# EAGLE design PGA-103+ LNA Mod2 (EAGLE 7.7.0)
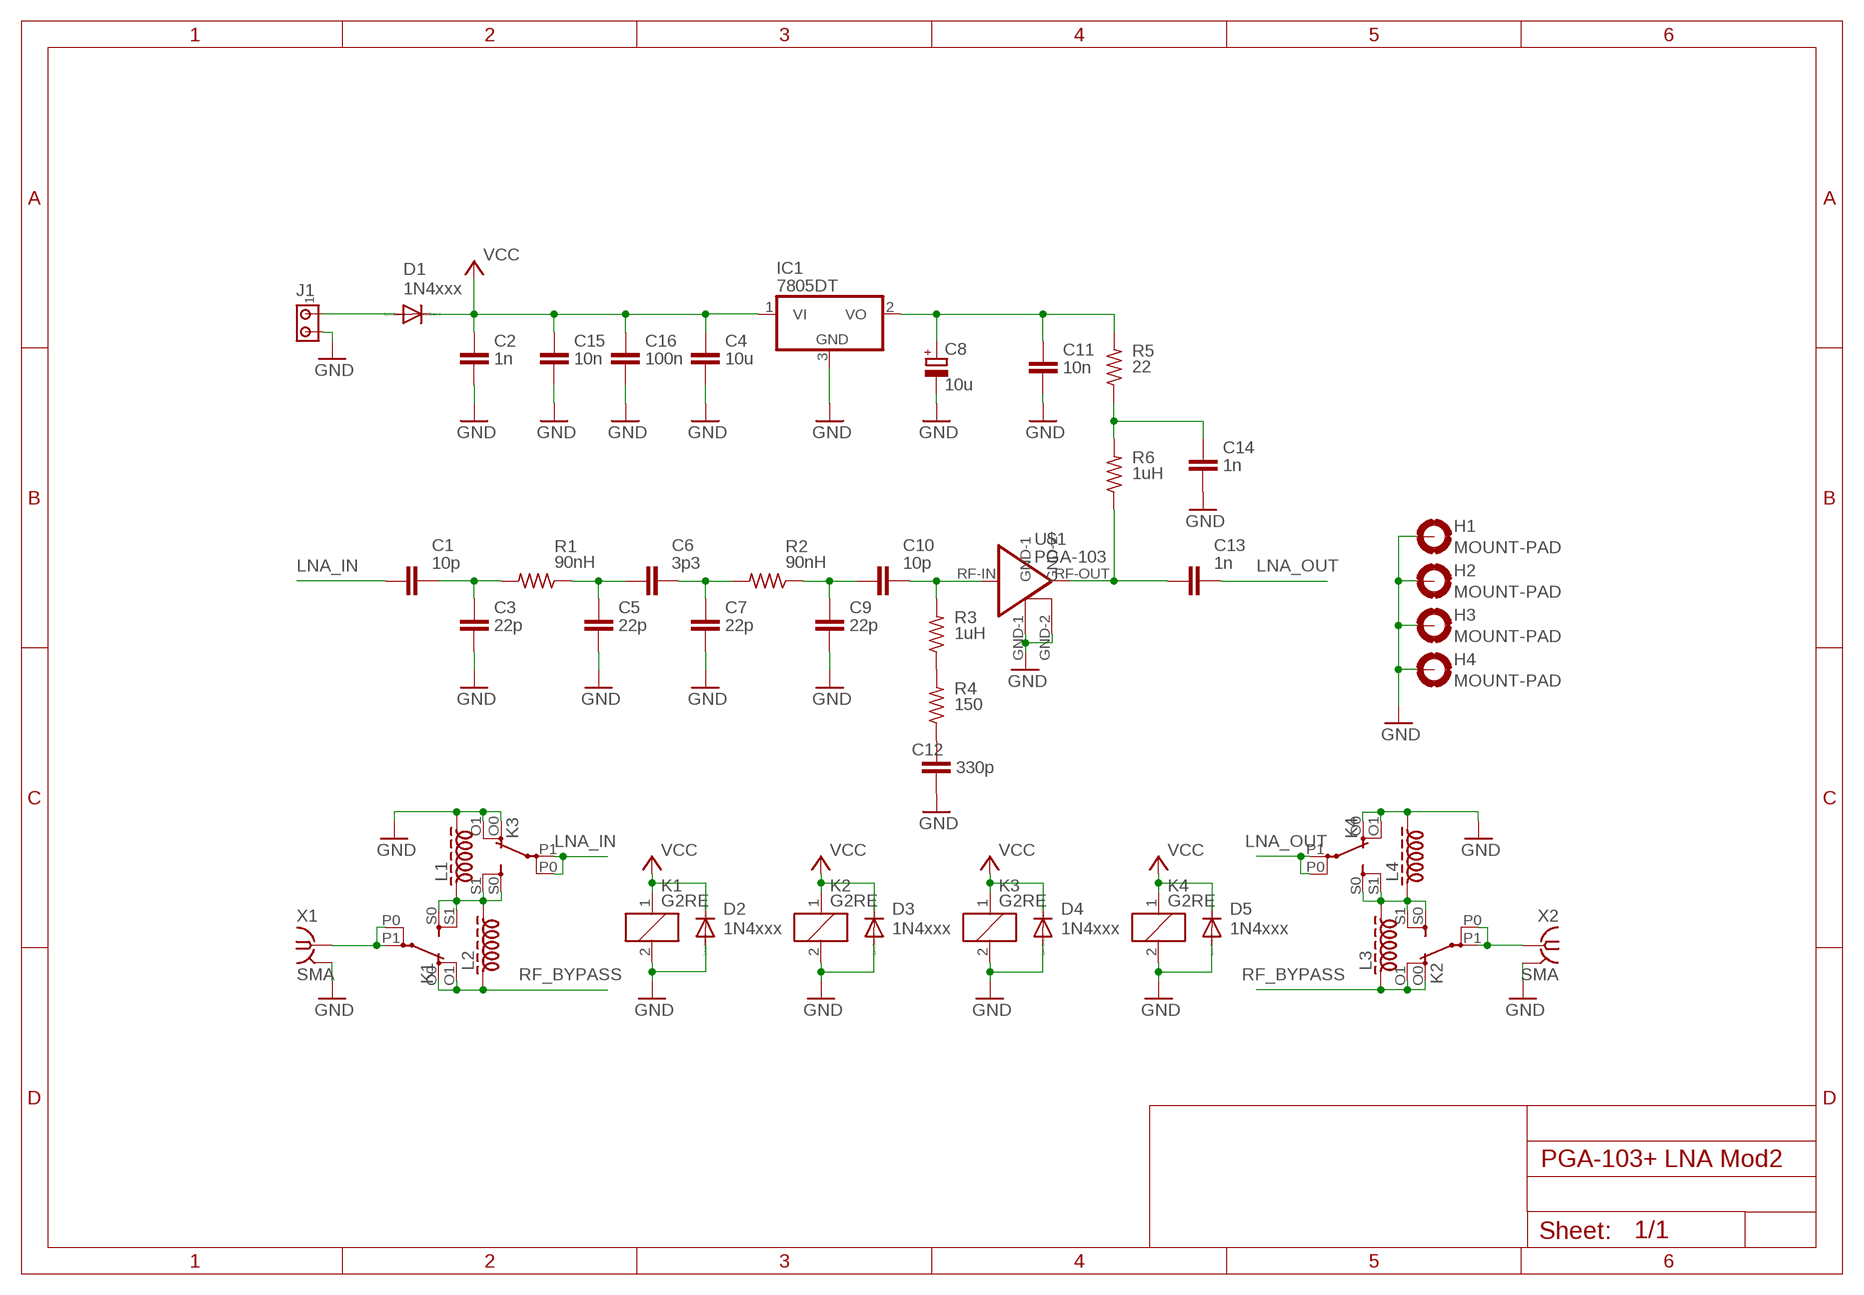
[diagram p0: schematic, sheet 1]

## Parts
C1  10p  C-EUC1206  [C1206]
C2  1n  C-EUC1206  [C1206]
C3  22p  C-EUC1206  [C1206]
C4  10u  C-EUC1206  [C1206]
C5  22p  C-EUC1206  [C1206]
C6  3p3  C-EUC1206  [C1206]
C7  22p  C-EUC1206  [C1206]
C8  10u  CPOL-EUB/3528-21R  [B/3528-21R]
C9  22p  C-EUC1206  [C1206]
C10  10p  C-EUC1206  [C1206]
C11  10n  C-EUC1206  [C1206]
C12  330p  C-EUC1206  [C1206]
C13  1n  C-EUC1206  [C1206]
C14  1n  C-EUC1206  [C1206]
C15  10n  C-EUC1206  [C1206]
C16  100n  C-EUC1206  [C1206]
D1  1N4xxx  1N4148DO35-7  [DO35-7]
D2  1N4xxx  1N4148DO35-7  [DO35-7]
D3  1N4xxx  1N4148DO35-7  [DO35-7]
D4  1N4xxx  1N4148DO35-7  [DO35-7]
D5  1N4xxx  1N4148DO35-7  [DO35-7]
H1  MOUNT-PAD  MOUNT-PAD-ROUND2.8  [2,8-PAD]
H2  MOUNT-PAD  MOUNT-PAD-ROUND2.8  [2,8-PAD]
H3  MOUNT-PAD  MOUNT-PAD-ROUND2.8  [2,8-PAD]
H4  MOUNT-PAD  MOUNT-PAD-ROUND2.8  [2,8-PAD]
IC1  7805DT  [TO252]
J1  MTA02-156  [1X2MTA]
K1  G2RE  [G2RE]
K2  G2RE  [G2RE]
K3  G2RE  [G2RE]
K4  G2RE  [G2RE]
L1  Z28/70CW  [Z28/7]
L2  Z28/70CW  [Z28/7]
L3  Z28/70CW  [Z28/7]
L4  Z28/70CW  [Z28/7]
R1  90nH  R-US_M1206  [M1206]
R2  90nH  R-US_M1206  [M1206]
R3  1uH  R-US_M1206  [M1206]
R4  150  R-US_M1206  [M1206]
R5  22  R-US_M1206  [M1206]
R6  1uH  R-US_M1206  [M1206]
U$1  PGA-103  [DF782]
X1  SMA  SMA-142-0701-851/861  [J502-ND-142-0701-851/861]
X2  SMA  SMA-142-0701-851/861  [J502-ND-142-0701-851/861]

## Nets
ANT: K1.P0(2:P) K1.P1(2:P) X1.1
GND: C2.2 C3.1 C4.2 C5.1 C7.1 C8.- C9.1 C11.2 C12.1 C14.1 C15.2 C16.2 D2.A D3.A D4.A D5.A H1.B2,8(MOUNT) H2.B2,8(MOUNT) H3.B2,8(MOUNT) H4.B2,8(MOUNT) IC1.3(GND) J1.2 K1.2 K2.2 K3.2 K3.O0(2:O) K3.O1(2:O) K4.2 K4.O0(2:O) K4.O1(2:O) L1.2 L4.2 U$1.GND-1 U$1.GND-2 X1.G@1 X1.G@2 X1.G@3 X1.G@4 X2.G@1 X2.G@2 X2.G@3 X2.G@4
LNA_IN: C1.1 K3.P0(2:P) K3.P1(2:P)
LNA_OUT: C13.2 K4.P0(2:P) K4.P1(2:P)
N$1: C10.2 R3.2 U$1.RF-IN
N$3: C13.1 R6.1 U$1.RF-OUT
N$5: C8.+ C11.1 IC1.2(VO) R5.2
N$7: D1.A J1.1
N$8: C9.2 C10.1 R2.1
N$9: C14.2 R5.1 R6.2
N$10: R3.1 R4.2
N$11: C12.2 R4.1
N$12: C6.2 C7.2 R2.2
N$13: C5.2 C6.1 R1.1
N$14: C1.2 C3.2 R1.2
N$16: K1.S0(2:S) K1.S1(2:S) K3.S0(2:S) K3.S1(2:S) L1.1 L2.2
N$17: K2.S0(2:S) K2.S1(2:S) K4.S0(2:S) K4.S1(2:S) L3.2 L4.1
RF_BYPASS: K1.O0(2:O) K1.O1(2:O) K2.O0(2:O) K2.O1(2:O) L2.1 L3.1
TRX: K2.P0(2:P) K2.P1(2:P) X2.1
VCC: C2.1 C4.1 C15.1 C16.1 D1.C D2.C D3.C D4.C D5.C IC1.1(VI) K1.1 K2.1 K3.1 K4.1

## Library data of the parts
C1-C7 C9-C16 = rcl:C-EU: CAPACITOR, European symbol
C8 = rcl:CPOL-EU: POLARIZED CAPACITOR, European symbol
D1-D5 = diode:1N4148: DIODE high speed (Philips)
H1-H4 = holes:MOUNT-PAD-ROUND: MOUNTING PAD, round
IC1 = linear:78*: Positive VOLTAGE REGULATOR Source: http://cache.national.com/ds/LM/LM78L05.pdf http://www.fairchildsemi.com/ds/LM/LM7805.pdf
J1 = con-amp:MTA02-156: AMP connector
K1-K4 = relay:G2RE: RELAY 1 x switch, high current, Omron; OC_FARNELL: unknown; OC_NEWARK: unknown
L1-L4 = inductor-neosid:Z?CW: CHOKE free-suspension choke/nominal inductance winding clockwise; OC_FARNELL: unknown; OC_NEWARK: unknown
R1-R6 = rcl:R-US_: RESISTOR, American symbol
U$1 = minicircuits:PGA-103
X1 X2 = con-coax:SMA-: SMA 50 Ohm End Launch Jack Receptacle - Round Contact Johnson Components Source: www.johnsoncomponents.com .. J502-ND.pdf; MF: JOHNSON COMPONENTS; MPN: 142-0701-851; OC_FARNELL: 1019325; OC_NEWARK: 99F6798

## Board
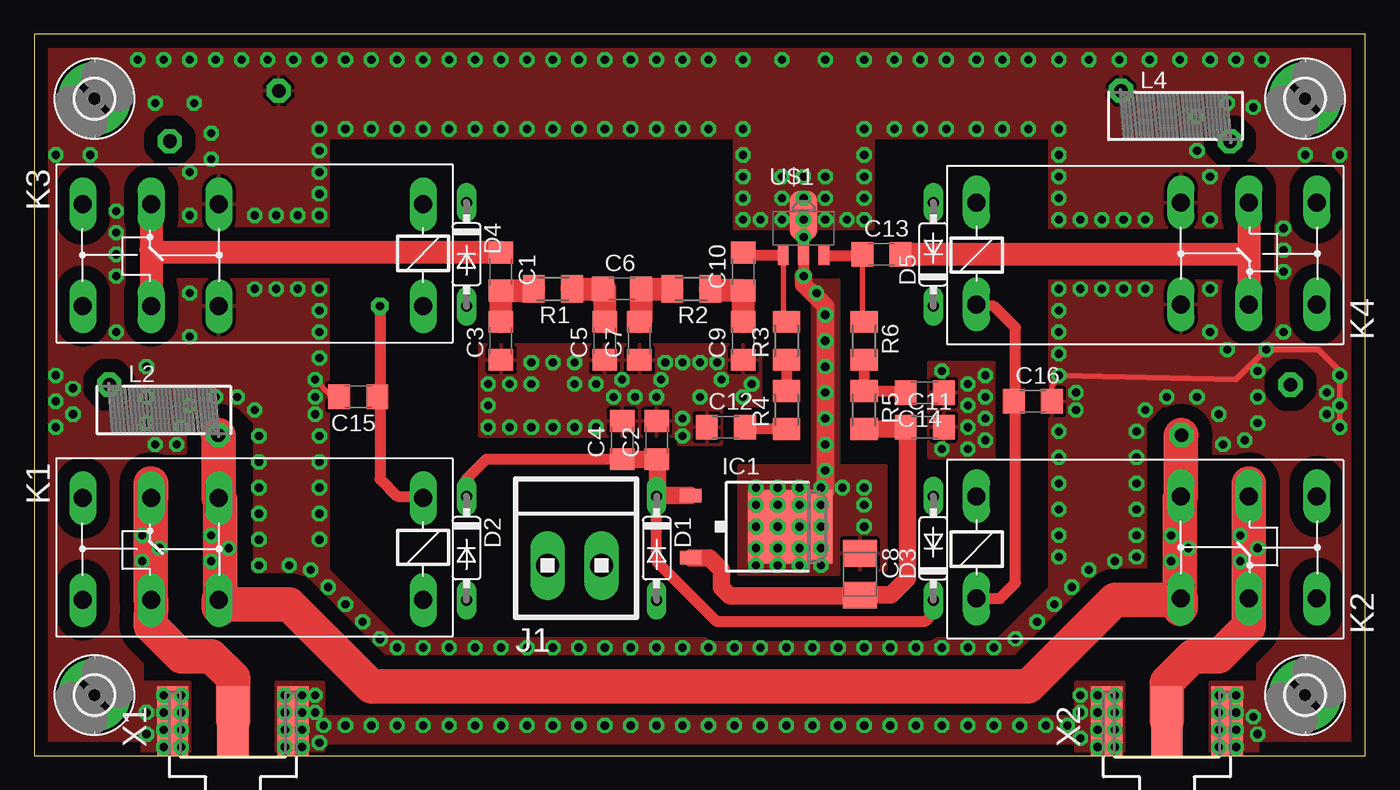
[diagram p1: board, top side]
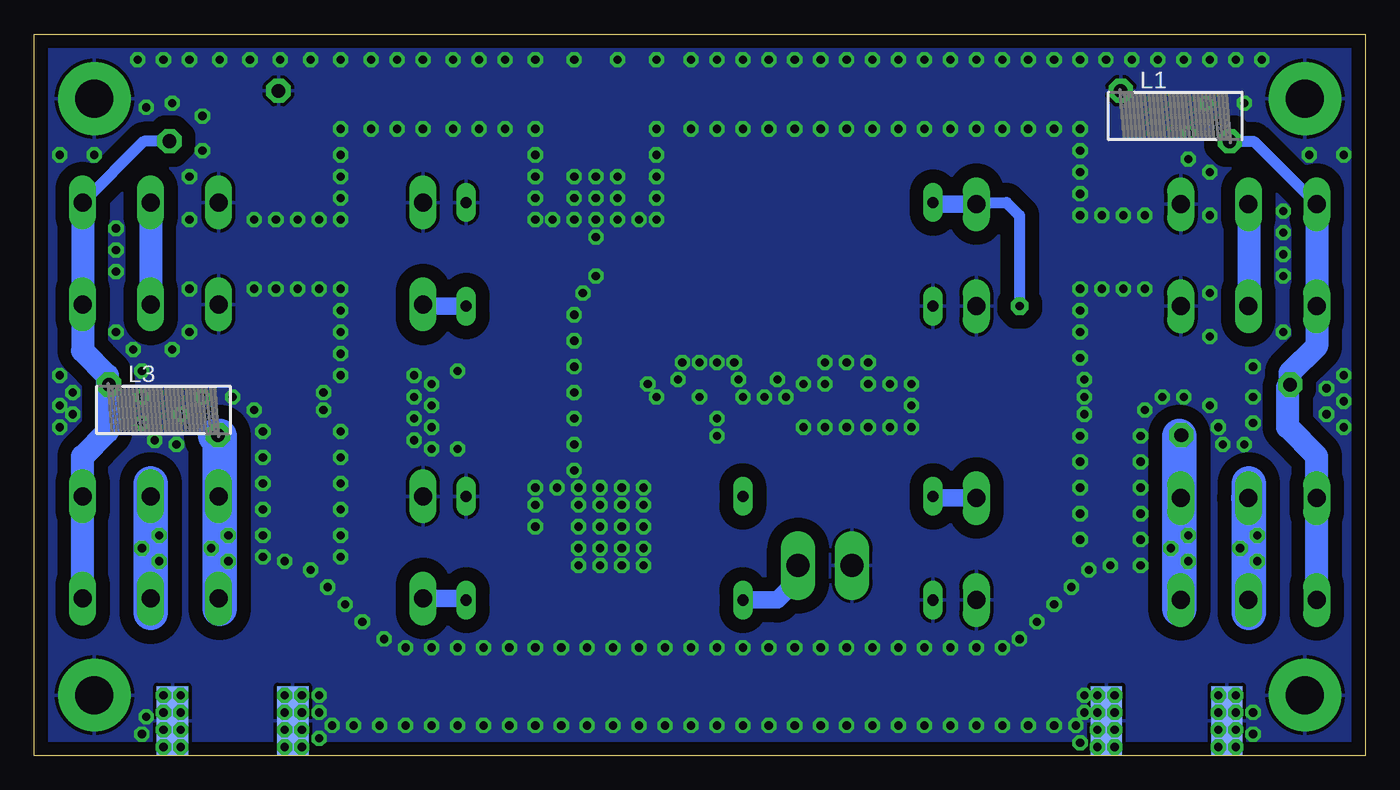
[diagram p2: board, bottom side, seen from below]

Size 97.77 x 53.01 mm. Coordinates in mm from the lower left corner, seen from the top.
Outline: 0,0 97.77,0 97.77,53.01 0,53.01 0,0
Copper layers (1*16): Top 0.035mm / dielectric 1.5mm / Bottom 0.035mm
Design rules "SparkFun": minimum track width 8mil, minimum drill 20mil, track to track 8mil, track to pad 8mil, pad to pad 8mil, via to via 8mil, smd to smd 8mil, copper to edge 10mil, drill to drill 8mil, minimum pad ring 12mil, minimum via ring 10mil, stop-mask expansion 4mil, vias tented up to drill 25mil, thermal gap 10mil

### Footprints (pad centres in the part's own frame; a part is rotated, then mirrored left to right if it is on the bottom)
C1206 = smd 1.6 x 1.8: 1 -1.4,0; 2 1.4,0
B/3528-21R = smd 1.95 x 2.5: + 1.525,0; - -1.525,0
DO35-7 = drill 0.813 long: A 3.81,0; C -3.81,0
2,8-PAD = drill 2.8 pad 5.334: B2,8 0,0
TO252 = smd 1 x 1.6: 1 -2.28,-4.8; 2 2.28,-4.8 | smd 5.4 x 6.2: 3 0,2.5
1X2MTA = drill 1.676 long: 1 1.981,0; 2 -1.981,0
G2RE = drill 1.321 long: 1 -2.54,-3.683; 2 -2.54,3.81; O0 12.471,-3.683; O1 12.471,3.81; P0 17.45,-3.683; P1 17.45,3.81; S0 22.454,-3.683; S1 22.454,3.81
Z28/7 = drill 1 pad 1.778 octagon: 1 4,-1.85; 2 -4,1.85
M1206 = smd 1.6 x 2: 1 -1.4,0; 2 1.4,0
DF782 = smd 0.8 x 1.9: GND-1 0,-1.727 | smd 2.032 x 3.65: GND-2 0,0.94 | smd 0.8 x 1.4: RF-IN -1.499,-1.981; RF-OUT 1.499,-1.981
J502-ND-142-0701-851/861 = smd 5.08 x 2.286: 1 2.565,0; G@1 2.565,4.42; G@2 2.565,-4.42 | smd 5.08 x 2.286 bottom: G@3 2.565,4.42; G@4 2.565,-4.42

### Placement (x,y rotation side)
C1  34.29,35.56 270 top
C2  45.72,23.18 90 top
C3  34.29,30.48 90 top
C4  43.18,23.18 90 top
C5  41.91,30.48 90 top
C6  43.18,34.29 0 top
C7  44.45,30.48 90 top
C8  60.64,13.34 270 top
C9  52.07,30.48 90 top
C10  52.07,35.56 90 top
C11  65.41,24.13 0 top
C12  50.8,24.13 0 top
C13  62.23,36.83 0 top
C14  65.41,26.67 180 top
C15  23.81,26.35 180 top
C16  73.34,26.04 0 top
D1  45.72,15.24 270 top
D2  31.75,15.24 270 top
D3  66.04,15.24 90 top
D4  31.75,36.83 270 top
D5  66.04,36.83 90 top
H1  4.45,4.45 0 top
H2  93.34,4.45 0 top
H3  93.34,48.26 0 top
H4  4.45,48.26 0 top
IC1  53.02,16.83 270 top
J1  39.69,13.97 0 top
K1  26.04,15.24 180 top
K2  71.75,15.24 0 top
K3  26.04,36.83 180 top
K4  71.75,36.83 0 top
L1  13.97,46.99 0 bottom
L2  9.53,25.4 0 top
L3  88.27,25.4 0 bottom
L4  83.82,46.99 0 top
R1  38.1,34.29 180 top
R2  48.26,34.29 180 top
R3  55.24,30.48 90 top
R4  55.24,25.4 90 top
R5  60.96,25.4 270 top
R6  60.96,30.48 270 top
U$1  56.52,38.73 0 top
X1  14.61,0 90 top
X2  83.19,0 90 top

### Tracks (layer width: path | path; a pad name or v marks a point on that pad's centre or on a via)
ANT  (via drill 0.6 pad 1.02)
  Top 2.54: K1.P0 8.59,19.99 8.57,20 8.57,11.44 K1.P1 8.56,9.54 10.79,7.3 13.02,7.3 14.61,5.71 X1.1
  Bottom 0.254: 8.57,18.94 v7.94,16.19 v9.21,15.24 v7.94,14.29
  Bottom 2.54: 8.57,18.94 8.57,10.48 | 8.57,20 8.57,18.94 | 8.57,18.94 K1.P0
GND  (via drill 0.6 pad 1.02)
  Top 0.254: v88.27,0.64 v88.27,1.91 X2.G@4 | v87,0.64 v87,1.91 | v78.11,0.64 v78.11,1.91 | v79.38,1.91 v79.38,0.64 | v79.38,1.91 78.77,2.52 X2.G@3 79.38,1.96 v79.38,1.91 | v9.53,0.64 v9.53,1.91 | v10.79,1.91 v10.79,0.64 | v18.41,1.91 v18.41,0.64 | v19.68,0.64 v19.68,1.91 X1.G@4 | X1.G@3 10.19,2.52 10.48,2.22 10.48,2.27 X1.G@3 | v10.79,3.17 X1.G@3
  Top 0.406: C15.2 21.91,26.35 v20.64,27.62 | C16.2 74.74,27.12 v75.25,27.94 88.27,27.62 v90.49,29.84 94.3,29.84 95.89,28.26 v95.89,24.13
  Top 0.813: U$1.GND-2 U$1.GND-1 v56.52,35.24
  Top 1.27: v56.52,35.24 56.52,34.61 58.1,33.02 58.1,19.37 57.15,18.41 57.11,18.41 IC1.3
  other vias: 26.67,2.22 57.47,33.97 58.1,32.38 58.1,30.48 58.1,28.57 56.52,39.37 58.1,39.37 54.93,39.37 54.93,40.96 56.52,40.96 58.1,40.96 58.1,42.55 56.52,42.55 54.93,42.55 56.52,38.1 53.02,16.83 54.61,16.83 56.2,16.83 57.78,16.83 57.78,15.24 56.2,15.24 54.61,15.24 53.02,15.24 53.02,18.41 54.61,18.41 56.2,18.41 57.78,18.41 57.78,13.97 56.2,13.97 54.61,13.97 53.02,13.97 53.02,19.68 54.61,19.68 56.2,19.68 57.78,19.68 59.37,19.68 60.96,16.83 60.96,18.41 60.96,19.68 58.1,26.67 58.1,24.77 68.58,22.54 68.58,24.13 68.58,25.72 68.58,27.3 69.85,23.18 69.85,24.77 69.85,26.35 69.85,27.94 66.67,22.54 66.67,28.26 26.67,7.94 28.57,7.94 30.48,7.94 32.38,7.94 34.29,7.94 36.2,7.94 38.1,7.94 40.01,7.94 41.91,7.94 43.81,7.94 45.72,7.94 47.62,7.94 49.53,7.94 51.44,7.94 53.34,7.94 55.24,7.94 57.15,7.94 59.05,7.94 60.96,7.94 62.87,7.94 64.77,7.94 66.67,7.94 68.58,7.94 70.48,7.94 72.07,8.57 73.66,9.84 74.93,11.11 76.2,12.38 77.47,13.65 79.38,14.29 80.96,14.61 80.96,16.19 80.96,18.1 80.96,20 80.96,21.91 80.96,23.81 81.6,25.4 83.19,26.35 85.41,26.35 87,25.08 87.31,22.86 88.9,23.18 89.85,24.45 89.85,26.35 89.85,28.26 94.93,26.67 94.93,25.08 95.89,27.94 95.89,25.72 88.27,3.17 87,3.17 88.27,4.45 87,4.45 78.11,3.17 79.38,3.17 79.38,4.45 78.11,4.45 9.53,3.17 9.53,4.45 10.79,4.45 18.41,3.17 19.68,3.17 19.68,4.45 18.41,4.45 28.57,2.22 30.48,2.22 32.38,2.22 34.29,2.22 36.2,2.22 38.1,2.22 40.01,2.22 41.91,2.22 43.81,2.22 45.72,2.22 47.62,2.22 49.53,2.22 51.44,2.22 53.34,2.22 55.24,2.22 57.15,2.22 59.05,2.22 60.96,2.22 62.87,2.22 64.77,2.22 66.67,2.22 68.58,2.22 70.48,2.22 72.39,2.22 74.3,2.22 75.88,2.22 24.77,2.22 22.86,2.22 21.27,2.22 25.4,8.57 24.13,9.84 22.86,11.11 21.59,12.38 20.32,13.65 18.73,13.97 16.51,13.97 16.51,15.88 16.51,17.78 16.51,19.68 16.51,21.59 16.51,23.5 16.19,25.4 14.92,26.35 13.34,26.35 11.43,25.72 10.79,24.13 10.48,22.86 8.89,22.86 8.26,24.45 8.26,26.35 8.26,28.57 2.86,25.08 2.86,26.99 1.59,26.04 1.59,24.13 1.59,27.94 33.34,24.13 34.92,24.13 36.51,24.13 38.1,24.13 39.69,24.13 41.27,24.13 42.55,26.35 44.13,26.35 45.72,26.35 47.62,24.77 47.62,23.5 48.9,26.35 52.07,26.35 52.7,27.3 33.34,25.72 33.34,27.3 34.92,27.3 36.51,27.3 36.51,28.89 38.1,28.89 39.69,28.89 39.69,27.3 41.27,27.3 43.18,27.62 46.04,27.62 46.35,28.89 48.9,28.89 50.16,28.89 47.62,28.89 50.48,27.62 6.03,31.11 6.03,35.24 6.03,36.83 6.03,38.42 6.03,40.01 91.76,38.73 91.76,37.15 91.76,35.56 91.76,31.11 75.25,34.29 76.83,34.29 78.42,34.29 80.01,34.29 81.6,34.29 75.25,39.37 76.83,39.37 78.42,39.37 80.01,39.37 81.6,39.37 86.36,39.37 86.36,34.29 59.69,39.37 60.96,39.37 60.96,40.96 60.96,42.55 65.09,46.04 66.99,46.04 69.22,46.04 71.12,46.04 73.03,46.04 75.25,46.04 75.25,40.96 60.96,44.13 60.96,46.04 63.18,46.04 75.25,42.55 75.25,44.13 53.34,39.37 52.07,39.37 52.07,40.96 52.07,42.55 52.07,44.13 52.07,46.04 49.53,46.04 47.62,46.04 45.72,46.04 43.81,46.04 41.91,46.04 40.01,46.04 38.1,46.04 36.2,46.04 34.29,46.04 32.38,46.04 30.48,46.04 28.57,46.04 26.67,46.04 24.77,46.04 22.86,46.04 20.95,46.04 20.95,44.45 20.95,42.86 20.95,39.69 20.95,41.27 19.37,39.69 17.78,39.69 16.19,39.69 11.43,39.69 11.43,42.86 1.59,44.13 4.13,44.13 8.89,47.94 11.75,47.94 13.02,45.72 13.02,43.81 11.43,33.97 16.19,34.29 17.78,34.29 19.37,34.29 20.95,34.29 11.43,30.8 86.36,42.55 85.41,44.45 85.41,46.99 87.63,47.94 89.53,47.62 86.36,31.11 87.63,29.84 93.34,44.13 95.89,44.13 58.1,22.86 58.1,20.95 20.95,15.88 20.95,17.78 20.95,19.68 20.95,21.59 20.95,23.5 20.64,25.08 20.95,29.21 20.95,31.11 20.95,32.7 75.25,32.7 75.25,31.11 75.25,29.53 76.52,25.4 75.25,23.81 75.25,21.91 75.25,20 75.25,18.1 75.25,16.19 75.25,14.61 20.95,51.12 22.86,51.12 24.77,51.12 26.67,51.12 28.57,51.12 30.48,51.12 32.38,51.12 34.29,51.12 36.2,51.12 38.1,51.12 40.01,51.12 41.91,51.12 43.81,51.12 45.72,51.12 47.62,51.12 49.53,51.12 52.07,51.12 60.96,51.12 54.93,51.12 58.1,51.12 63.18,51.12 65.09,51.12 66.99,51.12 69.22,51.12 71.12,51.12 73.03,51.12 75.25,51.12 77.47,51.12 79.69,51.12 81.92,51.12 84.14,51.12 86.36,51.12 88.27,51.12 90.17,51.12 19.05,51.12 17.14,51.12 15.24,51.12 13.34,51.12 11.43,51.12 9.53,51.12 7.62,51.12 89.85,1.59 89.53,2.86 76.83,4.45 76.83,1.27 76.83,3.17 8.26,1.59 8.26,3.17 20.64,4.45 20.64,3.17 20.95,0.95 76.52,26.67 20.64,26.35
  pour Bottom (isolate 1.016): 0,53.02 97.79,53.02 97.79,0 0,0
  pour Top: 32.7,30.16 53.34,30.16 53.34,25.72 50.48,25.72 50.48,22.86 47.31,22.86 47.31,23.5 32.7,23.5
  pour Top: 65.72,28.89 65.72,21.91 70.48,21.91 70.48,28.89
  pour Top: 58.74,13.65 62.55,13.65 62.55,21.27 58.74,21.27
  pour Top (no thermals): 51.75,21.27 59.05,21.27 59.05,13.34 51.75,13.34
  pour Top (no thermals): 51.44,46.67 61.59,46.67 61.59,38.73 51.44,38.73
  pour Top (no thermals): 57.15,34.92 59.05,34.92 59.05,20 57.15,20
  pour Top (no thermals): 20.95,2.86 76.83,2.86 76.83,0.95 20.95,0.95
  pour Top (isolate 1.016): 7.94,0 7.94,7.3 6.35,8.89 6.35,20.95 7.62,22.23 11.11,22.23 11.11,24.45 12.38,25.72 14.92,25.72 16.19,24.45 16.19,13.34 20,13.34 26.04,7.3 71.75,7.3 77.79,13.34 81.6,13.34 81.6,24.45 82.87,25.72 85.41,25.72 86.36,24.77 86.36,22.23 90.17,22.23 91.44,20.95 91.44,8.89 89.53,6.99 89.85,6.67 89.85,0 97.79,0 97.79,37.47 91.12,37.47 91.12,31.11 90.17,30.16 74.61,30.16 74.61,12.38 70.8,8.57 26.67,8.57 21.59,13.65 21.59,29.84 7.94,29.84 6.35,31.43 6.35,37.78 0,37.78 0,0
  pour Top (isolate 1.016): 0,28.89 0,53.02 97.79,53.02 97.79,29.21 74.61,29.21 74.61,45.4 21.59,45.4 21.59,28.89
  pour Top (no thermals): 86.36,5.4 89.85,5.4 89.85,0 86.36,0
  pour Top (no thermals): 76.52,5.4 80.01,5.4 80.01,0 76.52,0
  pour Top (no thermals): 17.78,5.4 21.27,5.4 21.27,0 17.78,0
  pour Top (no thermals): 7.94,5.4 11.43,5.4 11.43,0 7.94,0
LNA_IN
  Top 1.676: K3.P0 8.59,37.15 | 8.59,37.15 K3.P1 | C1.1 8.77,36.96 8.59,37.15
  Bottom 0.254: 8.57,40.64 K3.P0
  Bottom 1.676: 8.57,40.64 8.57,32.7
LNA_OUT
  Top 1.676: K4.P1 89.2,36.83 | 89.2,36.83 K4.P0 | C13.2 89.2,36.83
  Bottom 0.254: 89.22,40.64 K4.P1
  Bottom 1.676: 89.22,40.64 89.22,33.02
N$1
  Top 0.406: U$1.RF-IN 55.02,32.11 R3.2
  Top 0.813: U$1.RF-IN 52.28,36.75 C10.2
N$3
  Top 0.406: C13.1 60.83,32.01 R6.1
  Top 0.813: U$1.RF-OUT 60.75,36.75 C13.1
N$5
  Top 1.27: IC1.2 49.59,14.55 50.48,13.65 50.48,12.38 51.12,11.75 60.58,11.75 C8.+ 62.93,11.81 64.14,13.02 64.14,24 C11.1 63.88,24 R5.2
N$7
  Bottom 1.27: J1.1 41.67,12.94 43.18,11.43 D1.A
N$8
  Top 1.676: R2.1 49.79,34.16 C10.1 C9.2
N$9
  Top 0.813: R6.2 R5.1 63.88,26.8 C14.2
N$10
  Top 0.813: R3.1 R4.2
N$11
  Top 0.813: R4.1 52.33,24 C12.2
N$12
  Top 1.676: R2.2 C6.2 44.58,32.01 C7.2
N$13
  Top 1.676: R1.1 C6.1 41.91,34.29 C5.2
N$14
  Top 1.676: R1.2 36.57,34.16 C1.2 C3.2
N$16
  Bottom 0.813: L1.1 8.21,45.14 K3.S0
  Bottom 1.676: K1.S1 K1.S0 3.58,22 5.71,24.13 5.71,27.06 L2.2 5.53,28.13 3.58,30.07 K3.S1 K3.S0
N$17
  Bottom 0.813: L4.1 89.71,45.14 K4.S1
  Bottom 1.676: K4.S1 K4.S0 94.21,29.76 92.39,27.94 92.39,27.38 L3.2 92.39,27.12 92.39,23.81 94.21,22 K2.S1 K2.S0
RF_BYPASS  (via drill 0.6 pad 1.02)
  Top 0.254: 84.14,18.96 v83.5,16.19 v84.77,15.24 v83.5,14.29 | 13.65,18.83 v13.02,16.19 v14.29,15.24 v13.02,14.29
  Top 2.54: K1.O1 13.56,10.88 13.65,10.79 13.65,11.11 | L2.1 13.56,23.51 K1.O0 13.65,18.83 13.65,11.11 | L3.1 84.23,23.51 K2.O1 84.14,18.96 84.14,10.79 84.23,10.88 K2.O0 84.1,11.43 79.38,11.43 73.03,5.08 24.77,5.08 18.73,11.11 13.65,11.11
  Bottom 1.016: 84.14,10.79 84.14,11.47 K2.O0
  Bottom 1.27: 13.65,11.34 K1.O1
  Bottom 2.54: 13.65,23.5 13.65,11.34 13.65,10.79 | 84.45,23.5 84.14,23.5 84.14,10.79
TRX  (via drill 0.6 pad 1.02)
  Top 0.254: v88.58,16.19 89.22,16.19 v89.85,15.24 v88.58,14.29
  Top 2.54: K2.P1 89.2,19.99 89.22,20 89.22,16.19 89.22,11.57 K2.P0 89.2,9.51 87,7.3 85.09,7.3 83.19,5.4 X2.1
  Bottom 1.016: 89.22,20 89.22,19.06 K2.P1
  Bottom 2.54: 89.22,20 89.22,10.48
VCC  (via drill 0.6 pad 1.27)
  Top 0.406: C15.1 25.4,26.35 | C16.1 72.07,26.04
  Top 0.813: C4.1 33.21,21.78 31.75,20.32 D2.C | D3.C 66.04,10.48 65.41,9.84 50.16,9.84 45.72,14.29 D1.C | K2.1 70.93,11.56 72.07,12.7 72.07,26.04 72.07,31.43 70.48,33.02 K4.1 | v25.4,33.02 25.4,26.35 25.4,20.32 26.67,19.05 28.45,19.05 K1.1
  Top 1.27: IC1.1 45.78,19.11 | 45.78,19.11 D1.C | 45.78,19.11 45.78,21.72 C2.1 C4.1
  Bottom 0.813: 31.62,40.51 28.7,40.51 28.57,40.64 26.35,40.64 25.4,39.69 v25.4,33.02
  Bottom 1.27: K3.1 31.62,40.51 D4.C | D5.C 68.58,33.02 69.22,33.66 K4.1 | K2.1 66.17,11.56 D3.C | K1.1 31.62,18.92 D2.C